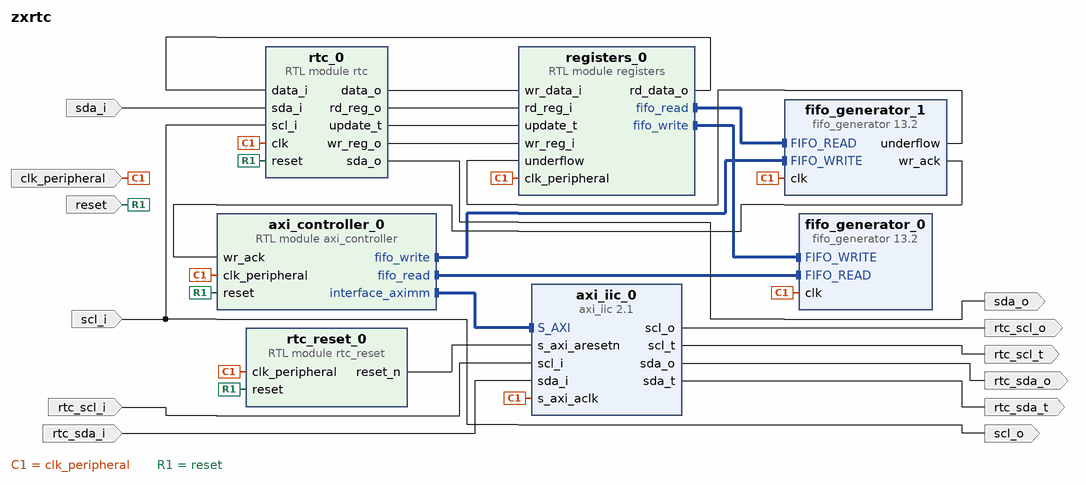
[diagram p0: block diagram of the top level]
# Vivado block design zxrtc, xc7a100tcsg324-1, Vivado 2021.2
create_bd_design zxrtc

create_bd_port -dir I -type clk clk_peripheral
set_property -dict {CONFIG.FREQ_HZ 28000000} [get_bd_ports clk_peripheral]
create_bd_port -dir I -type rst reset
set_property -dict {CONFIG.POLARITY ACTIVE_HIGH} [get_bd_ports reset]
create_bd_port -dir I scl_i
create_bd_port -dir O scl_o
create_bd_port -dir I sda_i
create_bd_port -dir O sda_o
create_bd_port -dir I rtc_scl_i
create_bd_port -dir O rtc_scl_o
create_bd_port -dir O rtc_scl_t
create_bd_port -dir I rtc_sda_i
create_bd_port -dir O rtc_sda_o
create_bd_port -dir O rtc_sda_t

create_bd_cell -type ip -vlnv xilinx.com:ip:fifo_generator:13.2 fifo_generator_0
set_property -dict [list \
  CONFIG.Data_Count false \
  CONFIG.Fifo_Implementation Common_Clock_Block_RAM \
  CONFIG.Input_Data_Width 15 \
  CONFIG.Input_Depth 512 \
  CONFIG.Output_Data_Width 15 \
  CONFIG.Performance_Options First_Word_Fall_Through \
  CONFIG.Reset_Pin false \
  CONFIG.Valid_Flag false \
  CONFIG.Write_Acknowledge_Flag false \
] [get_bd_cells fifo_generator_0]
create_bd_cell -type ip -vlnv xilinx.com:ip:fifo_generator:13.2 fifo_generator_1
set_property -dict [list \
  CONFIG.Data_Count false \
  CONFIG.Fifo_Implementation Common_Clock_Block_RAM \
  CONFIG.Input_Data_Width 14 \
  CONFIG.Input_Depth 512 \
  CONFIG.Output_Data_Width 14 \
  CONFIG.Performance_Options First_Word_Fall_Through \
  CONFIG.Reset_Pin false \
  CONFIG.Underflow_Flag true \
  CONFIG.Valid_Flag false \
  CONFIG.Write_Acknowledge_Flag true \
] [get_bd_cells fifo_generator_1]
create_bd_cell -type module -reference registers registers_0
set_property -dict {CONFIG.CLOCK_RATE 28000000} [get_bd_cells registers_0]
create_bd_cell -type module -reference axi_controller axi_controller_0
create_bd_cell -type ip -vlnv xilinx.com:ip:axi_iic:2.1 axi_iic_0
create_bd_cell -type module -reference rtc_reset rtc_reset_0
create_bd_cell -type module -reference rtc rtc_0

# ---- connections ----

connect_bd_intf_net [get_bd_intf_pins axi_controller_0/fifo_read] [get_bd_intf_pins fifo_generator_0/FIFO_READ]
connect_bd_intf_net [get_bd_intf_pins axi_controller_0/fifo_write] [get_bd_intf_pins fifo_generator_1/FIFO_WRITE]
connect_bd_intf_net [get_bd_intf_pins axi_iic_0/S_AXI] [get_bd_intf_pins axi_controller_0/interface_aximm]
connect_bd_intf_net -intf_net i2c_agent_0_fifo_read [get_bd_intf_pins registers_0/fifo_read] [get_bd_intf_pins fifo_generator_1/FIFO_READ]
connect_bd_intf_net -intf_net i2c_agent_0_fifo_write [get_bd_intf_pins registers_0/fifo_write] [get_bd_intf_pins fifo_generator_0/FIFO_WRITE]
connect_bd_net [get_bd_pins axi_iic_0/scl_o] [get_bd_ports rtc_scl_o]
connect_bd_net [get_bd_pins axi_iic_0/scl_t] [get_bd_ports rtc_scl_t]
connect_bd_net [get_bd_pins axi_iic_0/sda_o] [get_bd_ports rtc_sda_o]
connect_bd_net [get_bd_pins axi_iic_0/sda_t] [get_bd_ports rtc_sda_t]
connect_bd_net [get_bd_ports clk_peripheral] \
  [get_bd_pins fifo_generator_0/clk] [get_bd_pins fifo_generator_1/clk] [get_bd_pins registers_0/clk_peripheral] \
  [get_bd_pins axi_controller_0/clk_peripheral] [get_bd_pins axi_iic_0/s_axi_aclk] [get_bd_pins rtc_reset_0/clk_peripheral] \
  [get_bd_pins rtc_0/clk]
connect_bd_net [get_bd_pins fifo_generator_1/underflow] [get_bd_pins registers_0/underflow]
connect_bd_net [get_bd_pins fifo_generator_1/wr_ack] [get_bd_pins axi_controller_0/wr_ack]
connect_bd_net [get_bd_pins registers_0/rd_data_o] [get_bd_pins rtc_0/data_i]
connect_bd_net [get_bd_ports reset] [get_bd_pins axi_controller_0/reset] [get_bd_pins rtc_reset_0/reset] [get_bd_pins rtc_0/reset]
connect_bd_net [get_bd_pins rtc_0/data_o] [get_bd_pins registers_0/wr_data_i]
connect_bd_net [get_bd_pins rtc_0/rd_reg_o] [get_bd_pins registers_0/rd_reg_i]
connect_bd_net [get_bd_pins rtc_0/sda_o] [get_bd_ports sda_o]
connect_bd_net [get_bd_pins rtc_0/update_t] [get_bd_pins registers_0/update_t]
connect_bd_net [get_bd_pins rtc_0/wr_reg_o] [get_bd_pins registers_0/wr_reg_i]
connect_bd_net [get_bd_pins rtc_reset_0/reset_n] [get_bd_pins axi_iic_0/s_axi_aresetn]
connect_bd_net [get_bd_ports rtc_scl_i] [get_bd_pins axi_iic_0/scl_i]
connect_bd_net [get_bd_ports rtc_sda_i] [get_bd_pins axi_iic_0/sda_i]
connect_bd_net [get_bd_ports scl_i] [get_bd_ports scl_o] [get_bd_pins rtc_0/scl_i]
connect_bd_net [get_bd_ports sda_i] [get_bd_pins rtc_0/sda_i]

# ---- address map ----
assign_bd_address -offset 0x0000 -range 512 -target_address_space [get_bd_addr_spaces axi_controller_0/interface_aximm] [get_bd_addr_segs axi_iic_0/S_AXI/Reg]

validate_bd_design
save_bd_design
